# Altium schematic sheet SD.SchDoc
size A; SheetNumber: 5; SheetTotal: 9
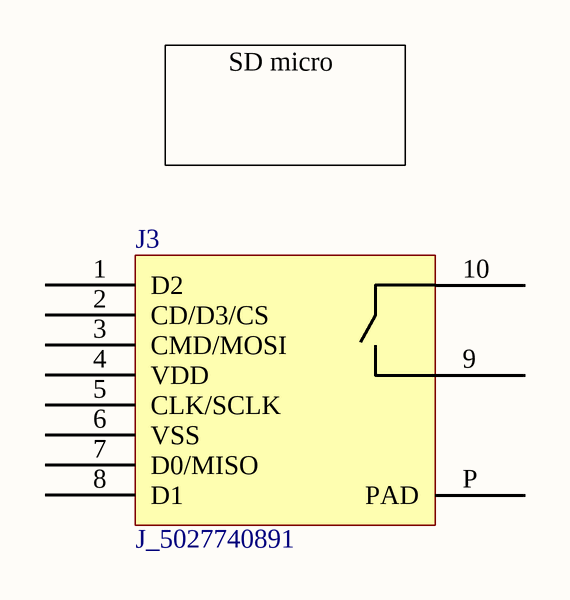
[diagram p0: SD.SchDoc]

## Parts
J3  J_5027740891  [usd slot 5027740891]

## Nets

Not connected (* = marked no-connect by the designer): J3 1(D2) 2(CD/D3/CS) 3(CMD/MOSI) 4(VDD) 5(CLK/SCLK) 6(VSS) 7(D0/MISO) 8(D1) 9 10 P(PAD)

## Notes on the sheet
- SD micro

## Library data of the parts
J3 = CMP-142-000000-4: CONN MICRO SD CARD PUSH-PUSH R/A; Max Current Rating: 500mA; Gender: Female; Mounting Technology: SMT; Pins: 12